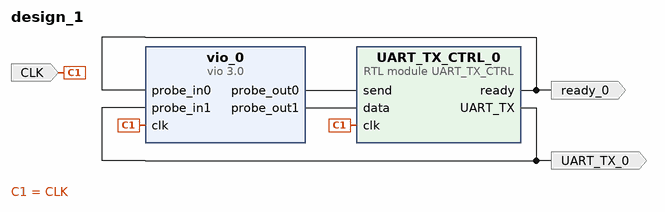
[diagram p0: block diagram of the top level]
# Vivado block design design_1, xc7a50ticsg324-1L, Vivado 2019.1
create_bd_design design_1

create_bd_port -dir O ready_0
create_bd_port -dir O UART_TX_0
create_bd_port -dir I -type clk CLK

create_bd_cell -type ip -vlnv xilinx.com:ip:vio:3.0 vio_0
set_property -dict [list \
  CONFIG.C_NUM_PROBE_IN 2 \
  CONFIG.C_NUM_PROBE_OUT 2 \
  CONFIG.C_PROBE_OUT1_INIT_VAL 0xAA \
  CONFIG.C_PROBE_OUT1_WIDTH 8 \
] [get_bd_cells vio_0]
create_bd_cell -type module -reference UART_TX_CTRL UART_TX_CTRL_0

# ---- connections ----

connect_bd_net [get_bd_pins UART_TX_CTRL_0/ready] [get_bd_ports ready_0] [get_bd_pins vio_0/probe_in0]
connect_bd_net [get_bd_pins UART_TX_CTRL_0/UART_TX] [get_bd_ports UART_TX_0] [get_bd_pins vio_0/probe_in1]
connect_bd_net [get_bd_pins vio_0/probe_out0] [get_bd_pins UART_TX_CTRL_0/send]
connect_bd_net -net clk_0_1 [get_bd_ports CLK] [get_bd_pins vio_0/clk] [get_bd_pins UART_TX_CTRL_0/clk]
connect_bd_net [get_bd_pins vio_0/probe_out1] [get_bd_pins UART_TX_CTRL_0/data]

validate_bd_design
save_bd_design
